# Altium schematic sheet NMosfet.SchDoc
size A4
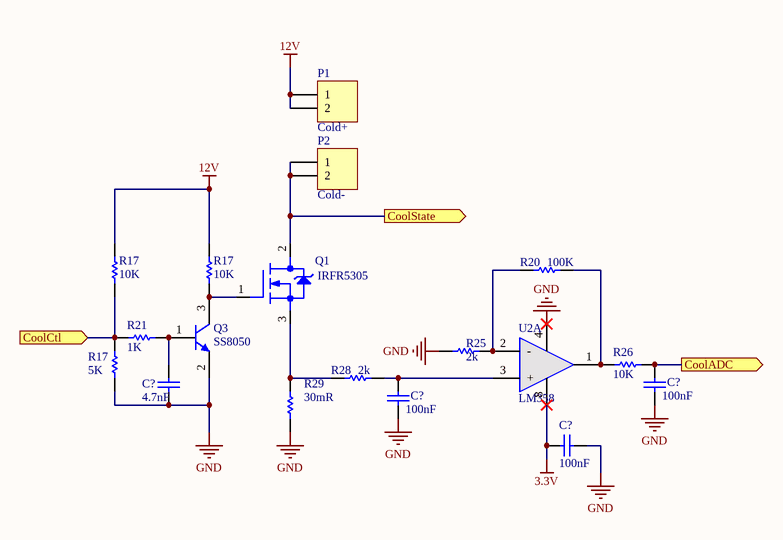
[diagram p0: NMosfet.SchDoc]

## Parts
(Parts that share a designator on the sheet are numbered #1, #2 ... from top to bottom, then left to right.)
C?#1  4.7nF (472) 10% 50V  [0603_C]  (value not drawn)
C?#2  100nF (104) 10% 50V  [0603_C]  (value not drawn)
C?#3  100nF (104) 10% 50V  [0603_C]  (value not drawn)
C?#4  100nF (104) 10% 50V  [0603_C]  (value not drawn)
P1  Cold+  [ConSlice0.5]
P2  Cold-  [ConSlice0.5]
Q1  IRFR5305  [DPAK]
Q3  SS8050  [SOT-23]
R17#1  10K  [RESC1608N-R0603]
R17#2  10K  [RESC1608N-R0603]
R17#3  5K  [RESC1608N-R0603]
R20  100K  [RESC1608N-R0603]
R21  1K  [RESC1608N-R0603]
R25  2k  [RESC1608N-R0603]
R26  10K  [RESC1608N-R0603]
R28  2k  [RESC1608N-R0603]
R29  30mR  [Rsense10mm]
U2  LM358  [NSO8_N]  (part A of 2)

## Ports
CoolADC (out), CoolCtl (in), CoolState (out)

## Nets
3.3V: C?#4.2 U2.8(V+)
12V: P1.1 P1.2 R17#1.1 R17#2.1
GND: C?#1.1 C?#2.1 C?#3.1 C?#4.1 Q3.2(E) R17#3.2 R25.2 R29.1 U2.4(V-)
CoolADC: C?#2.2 R26.1 ; port CoolADC
CoolCtl: R17#1.2 R17#3.1 R21.2 ; port CoolCtl
CoolState: P2.1 P2.2 Q1.2(D) ; port CoolState
NetC?#1_2: C?#1.2 Q3.1(B) R21.1
NetC?#3_2: C?#3.2 R28.1 U2.3(+)
NetQ1_1: Q1.1(G) Q3.3(C) R17#2.2
NetQ1_3: Q1.3(S) R28.2 R29.2
NetR20_1: R20.1 R26.2 U2.1(OUT1)
NetR20_2: R20.2 R25.1 U2.2(-)

## Notes on the sheet
- (in symbol 0603 4.7nF (472) 10% 50V) 4.7nF
- (in symbol 0603 100nF (104) 10% 50V) 100nF

## Library data of the parts
C?#1 = 0603 4.7nF (472) 10% 50V: 贴片电容; ComponentLink1Description: 供应商链接; ComponentLink1URL: http://www.szlcsc.com/product/details_55004.html; Package: 0603; Supplier: LC; SuppliersPartNumber: C53987
C?#2-C?#4 = 0603 100nF (104) 10% 50V: 贴片电容; ComponentLink1Description: 供应商链接; ComponentLink1URL: http://www.szlcsc.com/product/details_15331.html; Package: 0603; Supplier: LC; SuppliersPartNumber: C14663
P1 P2 = Header 2: Header, 2-Pin; LatestRevisionDate: 17-Jul-2002; LatestRevisionNote: Re-released for DXP Platform.; Publisher: Altium Limited
Q1 = SACE_MOSFET_N-CH_Z_GDS: Mfr_name1: ST; Mfr_Part_Number1: STD12NF06L; Part_Type: MOSFET\N-CHANNEL\SMD; RU_code: RU5189002; PackageID: D-PAK_AA_PITCH2.286MM_2PINS; Solderability_temp: 10s at 275°C; Max_operating_temp: +175°C; Min_operating_temp: -55°C; Prepared: BONOMI P.; Approved: MANZOLI R.; Notes: ST: / STD12NE06L-T4 is obsolete; Valore: STD12NF06L; Tolerance: -; Case_size: DPAK; Max_storage_temp: +175°C; Min_storage_temp: -55°C; Datasheet: K:\ORCAD CAPTURE CIS DATABASE\DATASHEET\DISCRETE; Make_date: L2587_DT; Last_rev_date: L3084_DT; RoHs: True; Export Control: N.A.
Q3 = SS8050: NPN贴片三极管; Published: 8-Jun-2000; LatestRevisionDate: 15-Jan-2003; LatestRevisionNote: PCB Footprint 'BCY-W3/D4.7' replaced; DatasheetDocument: 1997; PackageDocument: Sep-1998; PackageReference: TO-92A; Publisher: Altium Limited; Code_JEDEC: TO-92A; ComponentLink1Description: Manufacturer Link; ComponentLink1URL: http://www.fairchildsemi.com/; ComponentLink2Description: Datasheet; ComponentLink2URL: http://www.fairchildsemi.com/ds/2N%2F2N3904.pdf
R17#1 R17#2 R26 = RES1: 10K/±10%; 零件名称: 贴片电阻
R17#3 = RES1: 5K/±10%; 零件名称: 贴片电阻
R20 = RES1: 100K/±10%; 零件名称: 贴片电阻
R21 = RES1: 1K/±10%; 零件名称: 贴片电阻
R25 R28 = RES1: 2k/±10%; 零件名称: 贴片电阻
R29 = Res1: Resistor; Value: 2mR; Published: 8-Jun-2000; LatestRevisionDate: 17-Jul-2002; LatestRevisionNote: Re-released for DXP Platform.; PackageReference: AXIAL-0.3; Publisher: Altium Limited; PackageDescription: Axial Device, Thru-Hole; 2 Leads; 0.3 in Pin Spacing
U2 = LM358: 双运放